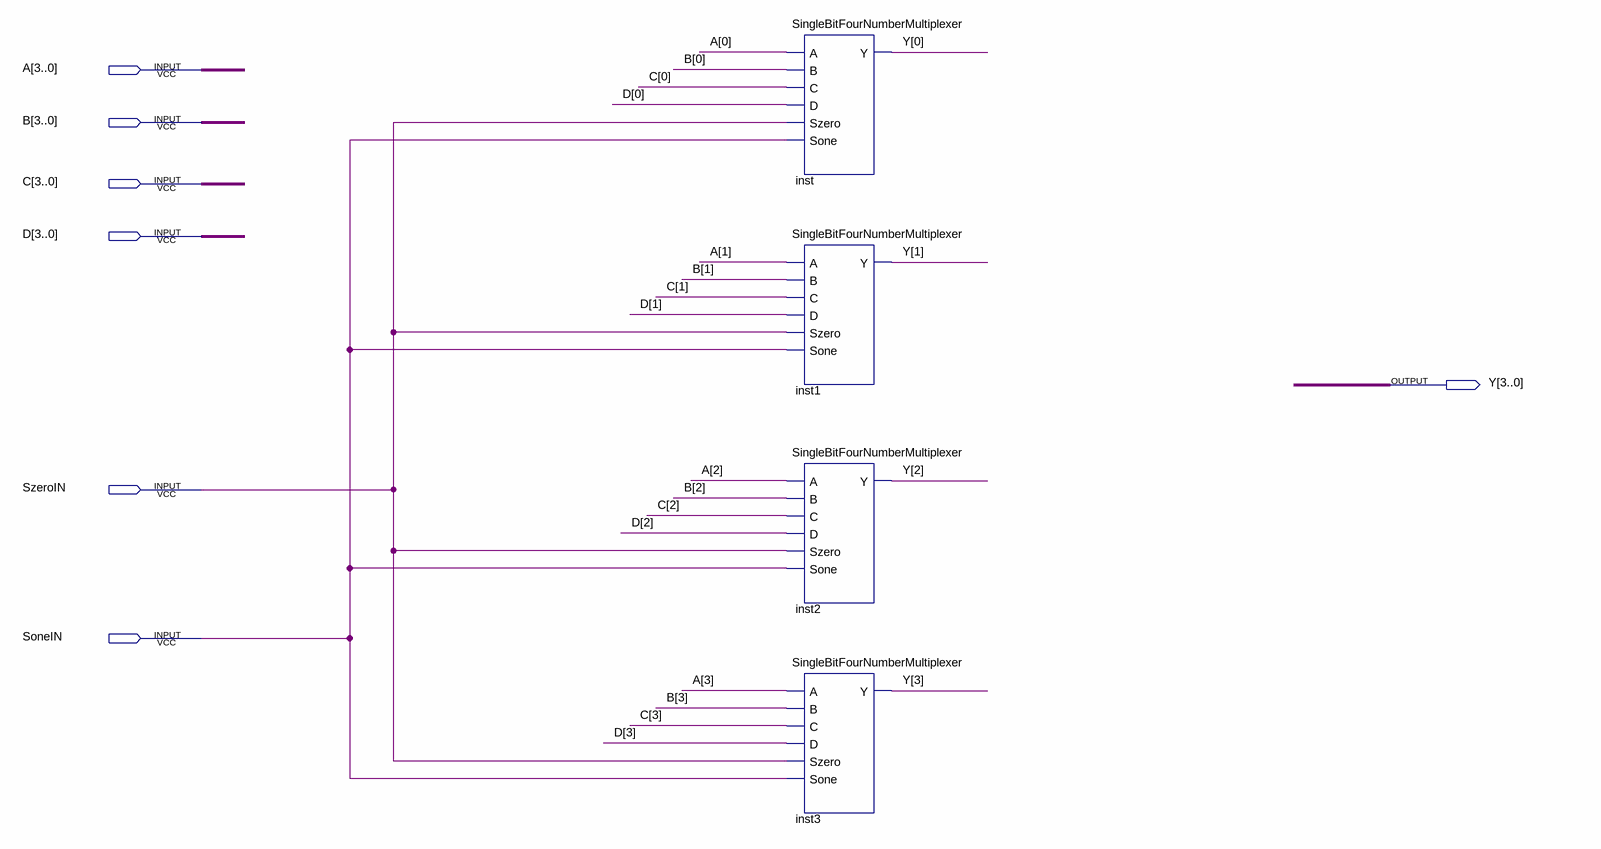
[diagram p0: schematic sheet]
// Quartus schematic FourBitFourNumberMultiplexer.bdf as structural Verilog: 4 symbols, 7 pins
module FourBitFourNumberMultiplexer (
  input  [3:0] A,
  input  [3:0] B,
  input  [3:0] C,
  input  [3:0] D,
  input  SzeroIN,
  input  SoneIN,
  output [3:0] Y
);

  SingleBitFourNumberMultiplexer inst (
    .A(A[0]), .B(B[0]), .C(C[0]), .D(D[0]), .Szero(SzeroIN), .Sone(SoneIN), .Y(Y[0]));
  SingleBitFourNumberMultiplexer inst1 (
    .A(A[1]), .B(B[1]), .C(C[1]), .D(D[1]), .Szero(SzeroIN), .Sone(SoneIN), .Y(Y[1]));
  SingleBitFourNumberMultiplexer inst2 (
    .A(A[2]), .B(B[2]), .C(C[2]), .D(D[2]), .Szero(SzeroIN), .Sone(SoneIN), .Y(Y[2]));
  SingleBitFourNumberMultiplexer inst3 (
    .A(A[3]), .B(B[3]), .C(C[3]), .D(D[3]), .Szero(SzeroIN), .Sone(SoneIN), .Y(Y[3]));
endmodule
